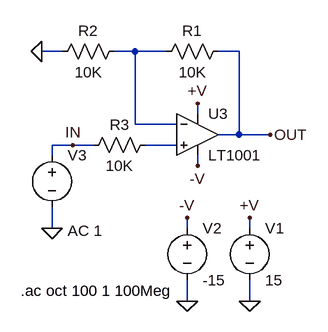
[diagram p0: schematic Fig_4-21_Group-Delay_1001.asc]
Fig_4-21_Group-Delay_1001.asc, the LTspice schematic file:
Version 4
SHEET 1 924 680
WIRE 48 80 16 80
WIRE 160 80 128 80
WIRE 208 80 160 80
WIRE 320 80 288 80
WIRE 256 176 256 160
WIRE 160 192 160 80
WIRE 224 192 160 192
WIRE 320 208 320 80
WIRE 320 208 288 208
WIRE 368 208 320 208
WIRE 64 224 32 224
WIRE 96 224 64 224
WIRE 224 224 176 224
WIRE 32 240 32 224
WIRE 256 256 256 240
WIRE 32 352 32 320
WIRE 240 352 240 336
WIRE 336 352 336 336
WIRE 240 464 240 432
WIRE 336 464 336 432
FLAG 336 464 0
FLAG 336 336 +V
FLAG 240 464 0
FLAG 240 336 -V
FLAG 32 352 0
FLAG 64 224 IN
FLAG 256 160 +V
FLAG 256 256 -V
FLAG 368 208 OUT
FLAG 16 80 0
SYMBOL voltage 336 336 R0
SYMATTR InstName V1
SYMATTR Value 15
SYMBOL voltage 240 336 R0
SYMATTR InstName V2
SYMATTR Value -15
SYMBOL voltage 32 224 R0
WINDOW 123 24 132 Left 2
WINDOW 39 0 0 Left 2
SYMATTR Value2 AC 1
SYMATTR InstName V3
SYMATTR Value ""
SYMBOL res 144 64 R90
WINDOW 0 0 56 VBottom 2
WINDOW 3 32 56 VTop 2
SYMATTR InstName R2
SYMATTR Value 10K
SYMBOL opamps\\LT1001 256 144 R0
SYMATTR InstName U3
SYMBOL res 192 96 R270
WINDOW 0 32 56 VTop 2
WINDOW 3 0 56 VBottom 2
SYMATTR InstName R1
SYMATTR Value 10K
SYMBOL res 192 208 R90
WINDOW 0 0 56 VBottom 2
WINDOW 3 32 56 VTop 2
SYMATTR InstName R3
SYMATTR Value 10K
TEXT -16 448 Left 2 !.ac oct 100 1 100Meg

The netlist it stands for:
* Fig_4-21_Group-Delay_1001.asc
V1 +V 0 15
V2 -V 0 -15
V3 IN 0 AC 1
R2 N001 0 10K
XU3 N002 N001 +V -V OUT LT1001  ; pins In+ In- V+ V- OUT
R1 N001 OUT 10K
R3 N002 IN 10K
.ac oct 100 1 100Meg
.lib LTC.lib
.backanno
.end